# Altium schematic sheet ADC.SchDoc
size Letter; DrawnBy: Robson Souza; SheetNumber: 8; SheetTotal: 9
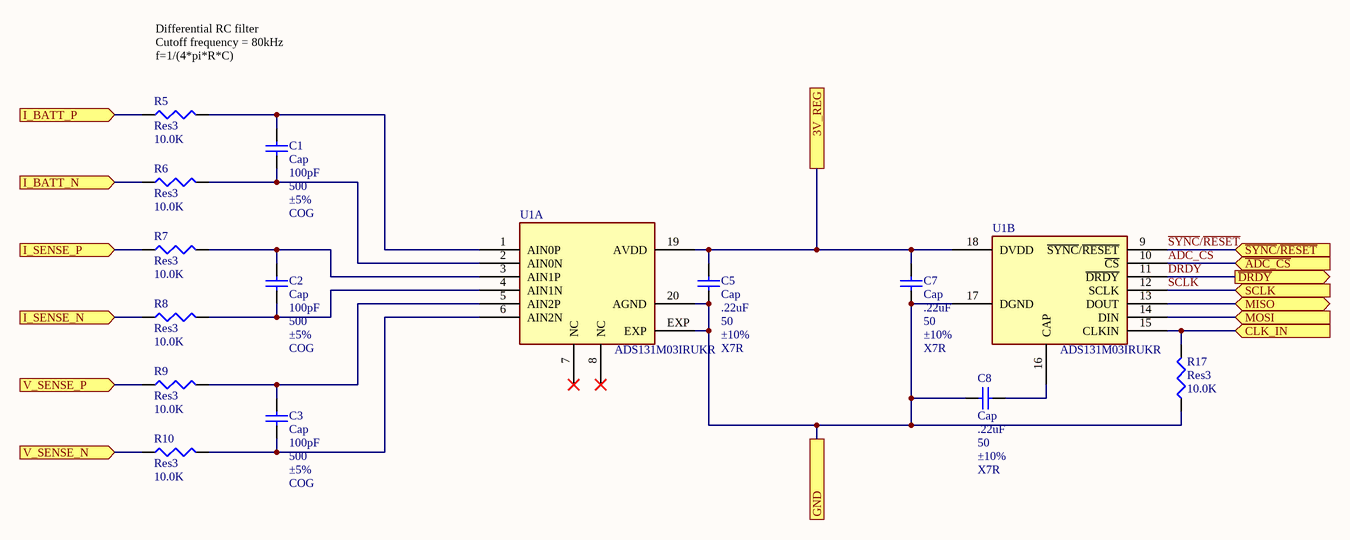
[diagram p0: ADC.SchDoc]

## Parts
C1  Cap  value 100pF  WV: 500  Tolerance: ±5%  Type: COG  [CAPC2012X09M]
C2  Cap  value 100pF  WV: 500  Tolerance: ±5%  Type: COG  [CAPC2012X09M]
C3  Cap  value 100pF  WV: 500  Tolerance: ±5%  Type: COG  [CAPC2012X09M]
C5  Cap  value .22uF  WV: 50  Tolerance: ±10%  Type: X7R  [CAPC2012X09M]
C7  Cap  value .22uF  WV: 50  Tolerance: ±10%  Type: X7R  [CAPC2012X09M]
C8  Cap  value .22uF  WV: 50  Tolerance: ±10%  Type: X7R  [CAPC2012X09M]
R5  Res3  value 10.0K  [RESC2112X05M]
R6  Res3  value 10.0K  [RESC2112X05M]
R7  Res3  value 10.0K  [RESC2112X05M]
R8  Res3  value 10.0K  [RESC2112X05M]
R9  Res3  value 10.0K  [RESC2112X05M]
R10  Res3  value 10.0K  [RESC2112X05M]
R17  Res3  value 10.0K  [RESC2112X05M]
U1  ADS131M03IRUKR  [20-WQFN]  (parts A,B of 2)

## Ports
3V_REG, CLK_IN (in), GND, I_BATT_N (in), I_BATT_P (in), I_SENSE_N (in), I_SENSE_P (in), MISO (bidir), MOSI (in), SCLK (in), V_SENSE_N (in), V_SENSE_P (in), ~{ADC_CS} (in), ~{DRDY} (out), ~{SYNC}/~{RESET} (in)

## Nets
3V_REG: C5.1 C7.1 U1.18(DVDD) U1.19(AVDD) ; port 3V_REG
~{ADC_CS}: U1.10(~{CS}) ; port ~{ADC_CS}
CLK_IN: R17.2 U1.15(CLKIN) ; port CLK_IN
~{DRDY}: U1.11(~{DRDY}) ; port ~{DRDY}
GND: C5.2 C7.2 C8.2 R17.1 U1.17(DGND) U1.20(AGND) U1.EXP ; port GND
I_BATT_N: R6.1 ; port I_BATT_N
I_BATT_P: R5.1 ; port I_BATT_P
I_SENSE_N: R8.1 ; port I_SENSE_N
I_SENSE_P: R7.1 ; port I_SENSE_P
MISO: U1.13(DOUT) ; port MISO
MOSI: U1.14(DIN) ; port MOSI
~{SYNC}/~{RESET}: U1.9(~{SYNC}/~{RESET}) ; port ~{SYNC}/~{RESET}
SCLK: U1.12(SCLK) ; port SCLK
V_SENSE_N: R10.1 ; port V_SENSE_N
V_SENSE_P: R9.1 ; port V_SENSE_P
NetC1_1: C1.1 R6.2 U1.2(AIN0N)
NetC1_2: C1.2 R5.2 U1.1(AIN0P)
NetC2_1: C2.1 R8.2 U1.4(AIN1N)
NetC2_2: C2.2 R7.2 U1.3(AIN1P)
NetC3_1: C3.1 R10.2 U1.6(AIN2N)
NetC3_2: C3.2 R9.2 U1.5(AIN2P)
NetC8_1: C8.1 U1.16(CAP)

Not connected (* = marked no-connect by the designer): U1 7(NC)* 8(NC)*

## Notes on the sheet
- (near R5) Differential RC filter
  Cutoff frequency = 80kHz
  f=1/(4*pi*R*C)

## Library data of the parts
C1-C3 = CAP-COG-100pF-500V-±5%: CAP CER 100pF 500v COG 0805; MPN: C0805C101JCGACTU; PN: 399-5102-1-ND; Name: CAP-COG-100pF-500V-±5%; URL: http://www.digikey.ca/product-detail/en/C0805C101JCGACTU/399-5102-1-ND
C5 C7 C8 = CAP-X7R-.22uF-50V-±10%: CAP CER .22uF 50v X7R 0805; MPN: C0805C224K5RACTU; PN: 399-3491-1-ND; Name: CAP-X7R-.22uF-50V-±10%; URL: http://www.digikey.ca/product-detail/en/C0805C224K5RACTU/399-3491-1-ND
R5-R10 R17 = Resistor_10.0K: RES SMD 10.0K OHM 1% 1/8W 0805; MPN: CRCW080510K0FKEA; PN: 541-10.0KCCT-ND; Name: Resistor_10.0K; URL: http://www.digikey.ca/product-detail/en/CRCW080510K0FKEA/541-10.0KCCT-ND
U1 = ADS131M03IRUKR: 3-Channel, Simultaneously-Sampling, 24-Bit, Delta-Sigma ADC